# Altium schematic sheet IMU_sensor_pwr.SchDoc
size 420 x 297 mm; SheetNumber: 3; SheetTotal: 4
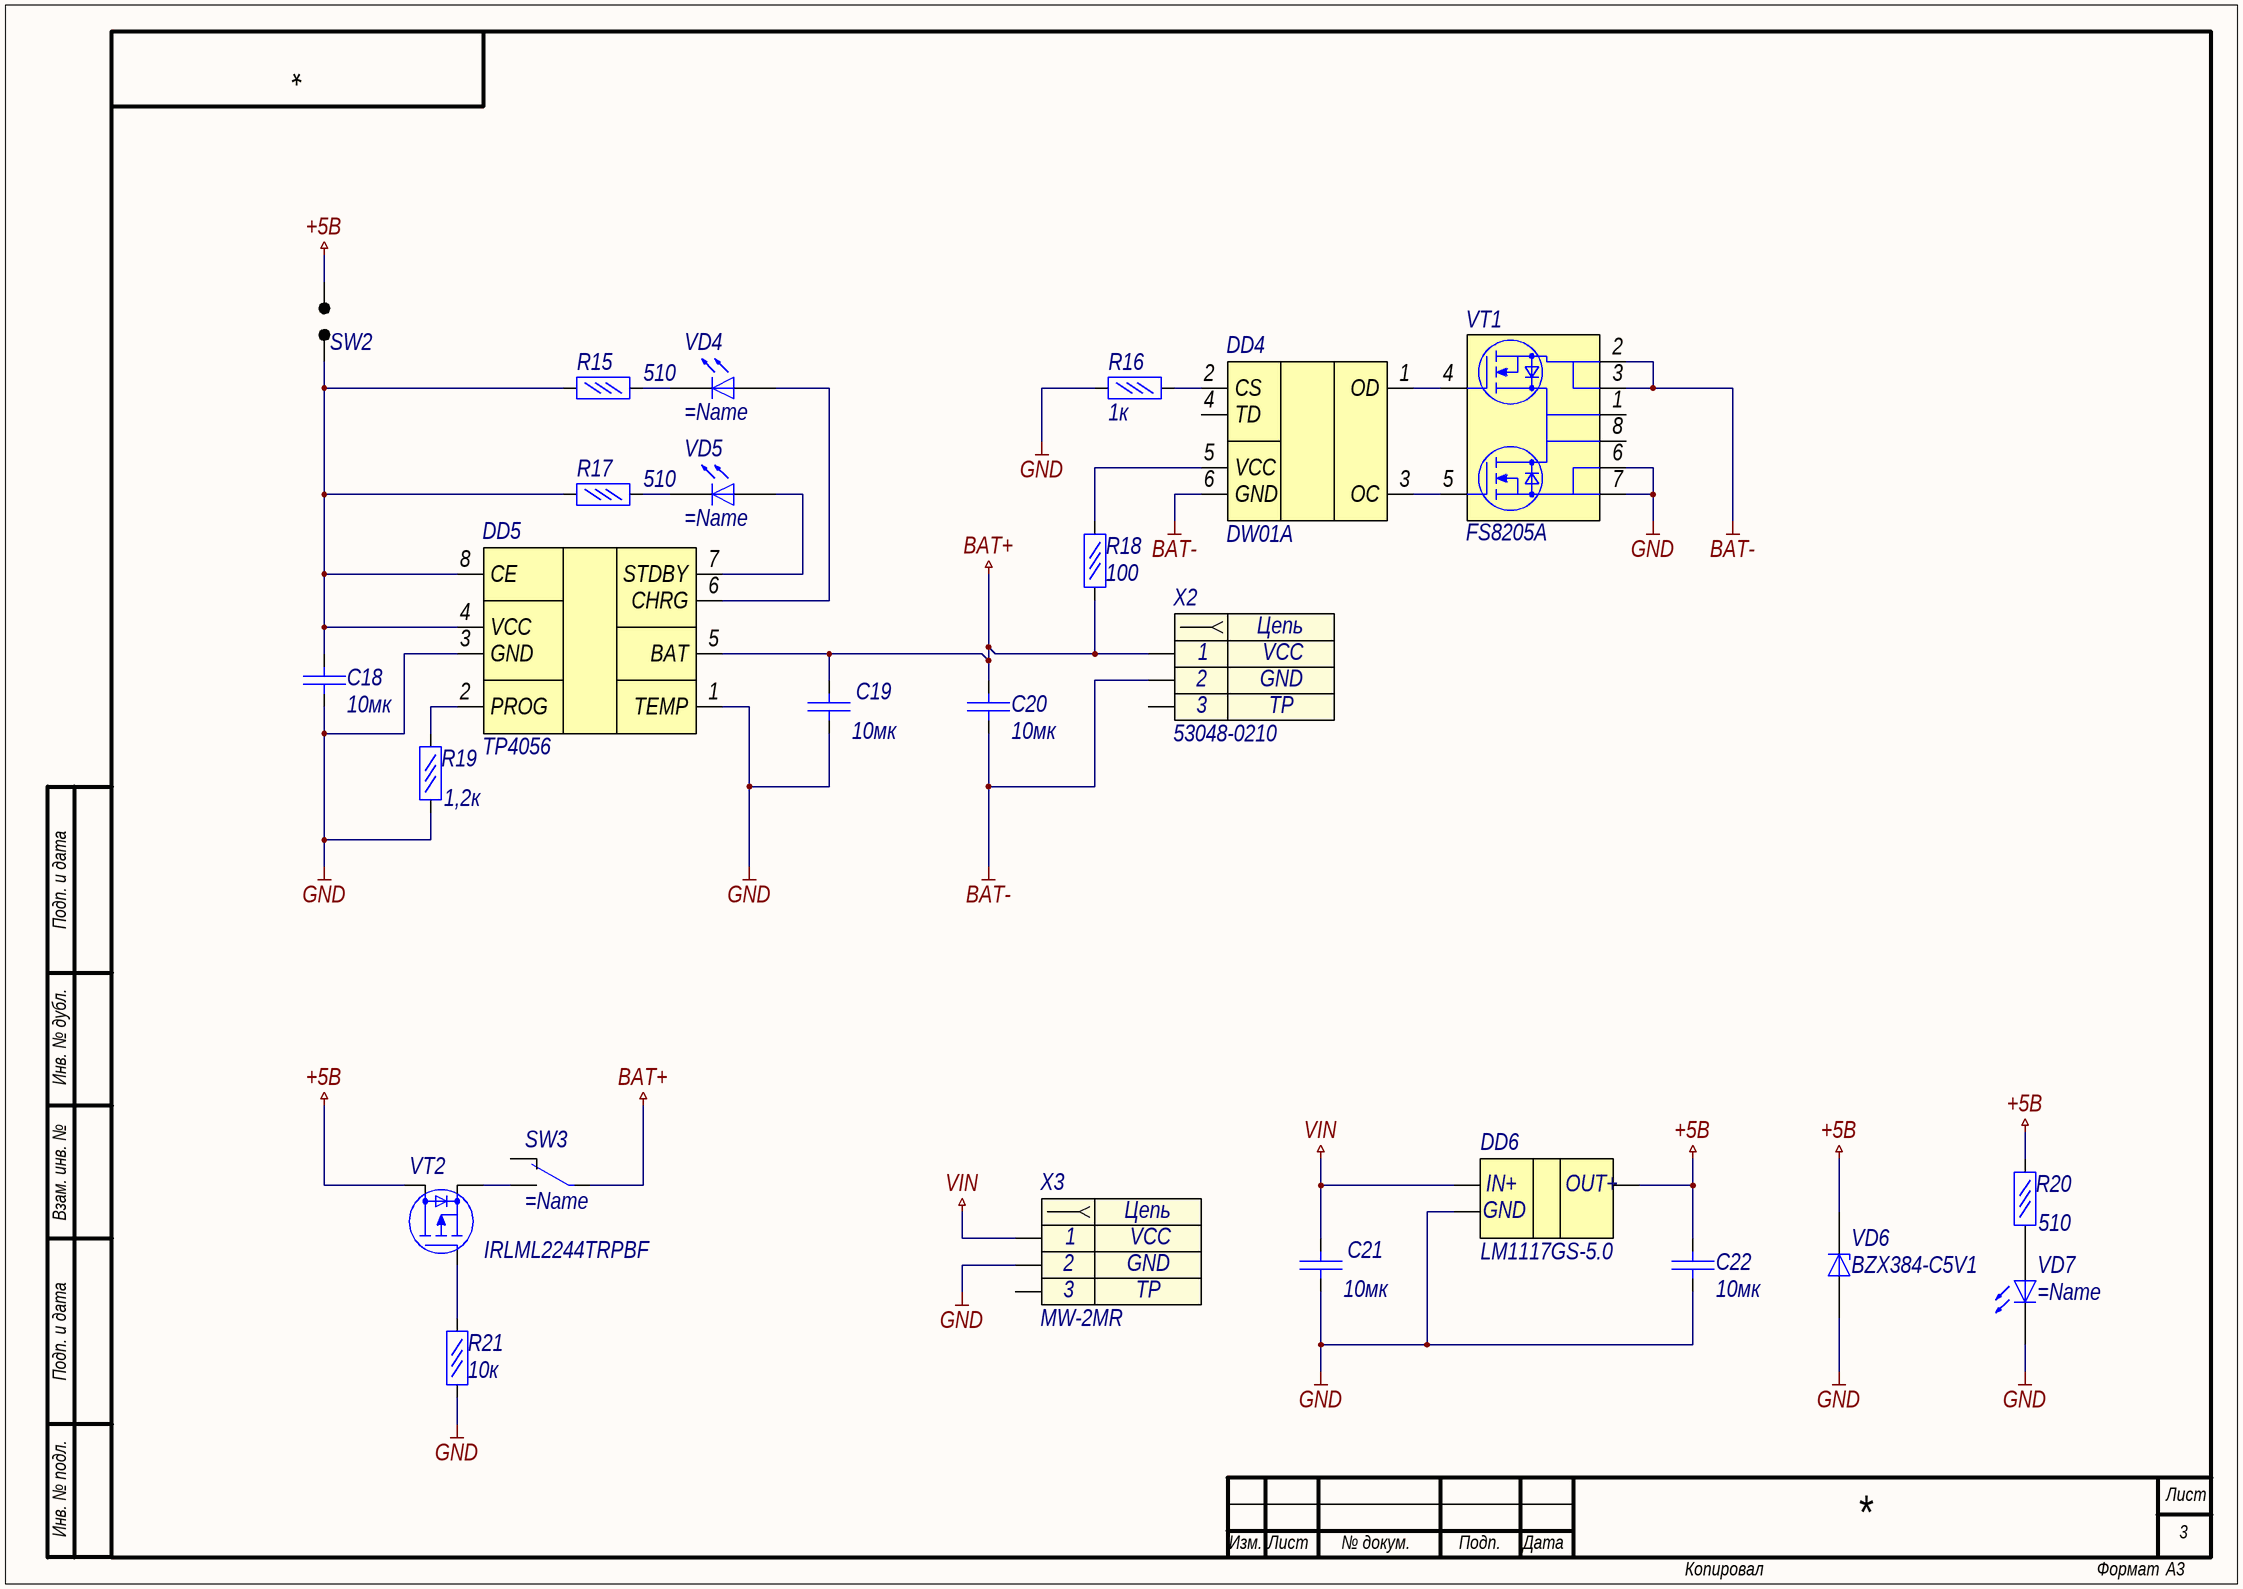
[diagram p0: IMU_sensor_pwr.SchDoc]

## Parts
DD4  DW01A  [SOT23-6]
DD5  TP4056  [SOP-8]
DD6  LM1117GS-5.0  [SOT-223]
R15  510  [R0402]
R16  1к  [R0402]
R17  510  [R0402]
R18  100  [R0402]
R19  1,2к  [R0402]
R20  510  [R0402]
R21  10к  [R0402]
SW2  (no value)  [Jumper_0.5x1]
SW3  (no value)  [MK12C02]
VD4  (no value)  [0603 - led]
VD5  (no value)  [0603 - led]
VD6  BZX384-C5V1  [SOD323]
VD7  (no value)  [0603 - led]
VT1  FS8205A  [TSSOP-8]
VT2  IRLML2244TRPBF  [SOT23]
X2  53048-0210  [53048-0210]
X3  MW-2MR  [MW-2MR]
С18  10мк  [C0603]
С19  10мк  [C0603]
С20  10мк  [C0603]
С21  10мк  [C0603]
С22  10мк  [C0603]

## Nets
+5В: DD6.2 R20.2 SW2.2 VD6.2(K) VT2.3(D) С22.2
BAT+: DD5.5(BAT) R18.2 SW3.1 X2.1 С19.2 С20.1
BAT-: DD4.6(GND) VT1.2(S1) VT1.3(S1) X2.2 С20.2
GND: DD5.1(TEMP) DD5.3(GND) DD6.1 R16.2 R19.1 R21.2 VD6.1(A) VD7.2(K) VT1.6(S2) VT1.7(S2) X3.2 С18.2 С19.1 С21.1 С22.1
VIN: DD6.3 X3.1 С21.2
NetDD4_1: DD4.1(OD) VT1.4(G1)
NetDD4_2: DD4.2(CS) R16.1
NetDD4_3: DD4.3(OC) VT1.5(G2)
NetDD4_5: DD4.5(VCC) R18.1
NetDD5_2: DD5.2(PROG) R19.2
NetDD5_4: DD5.4(VCC) DD5.8(CE) R15.2 R17.2 SW2.1 С18.1
NetDD5_6: DD5.6(CHRG) VD4.1(A)
NetDD5_7: DD5.7(STDBY) VD5.1(A)
NetR15_1: R15.1 VD4.2(K)
NetR17_1: R17.1 VD5.2(K)
NetR20_1: R20.1 VD7.1(A)
NetR21_1: R21.1 VT2.1(G)
NetSW3_3: SW3.3 VT2.2(S)

Not connected (* = marked no-connect by the designer): DD4 4(TD); SW3 2; VT1 1(D12) 8(D12); X2 0; X3 0

## Notes on the sheet
- Подп. и дата
- Инв. № дубл.
- Взам. инв. №
- Инв. № подл.
- Лист
- Изм.
- № докум.
- Подп.
- Дата
- Копировал
- Формат
- А3
- (in symbol Header_2) Цепь; 3

## Library data of the parts
DD4 = DW01A: контроллер заряда; Name: DW01A
DD5 = TP4056: линейное зарядное устройство; Name: TP4056
DD6 = LM1117: Contact_1: IN+; Contact_2: GND; Contact_3: OUT+; Name: LM1117GS-5.0
R15-R21 = Резистор 0.05Вт: Резистор 0,05Вт
  R15 R17 R20: Value: 510
  R16: Value: 1к
  R18: Value: 100
  R19: Value: 1,2к
  R21: Value: 10к
SW2 = Jumper: Запаиваемая перемычка
SW3 = switch
VD4 VD5 VD7 = smd_led: smd led
VD6 = стабилитрон: Name: BZX384-C5V1
VT1 = FS8205A: мофсфет; Name: FS8205A
VT2 = IRLML2244TRPBF: мосфет n-канал IRLML2244TRPBF; Name: IRLML2244TRPBF
X2 X3 = Header_2: Разъем - 3 конт. розетка; Contact_1: VCC; Contact_2: GND; Contact_3: TP
  X2: Name: 53048-0210
  X3: Name: MW-2MR
С18-С22 = Кер. конденсатор: Value: 10мк